# EAGLE design Schematic 1.0 (EAGLE 8.3.2)
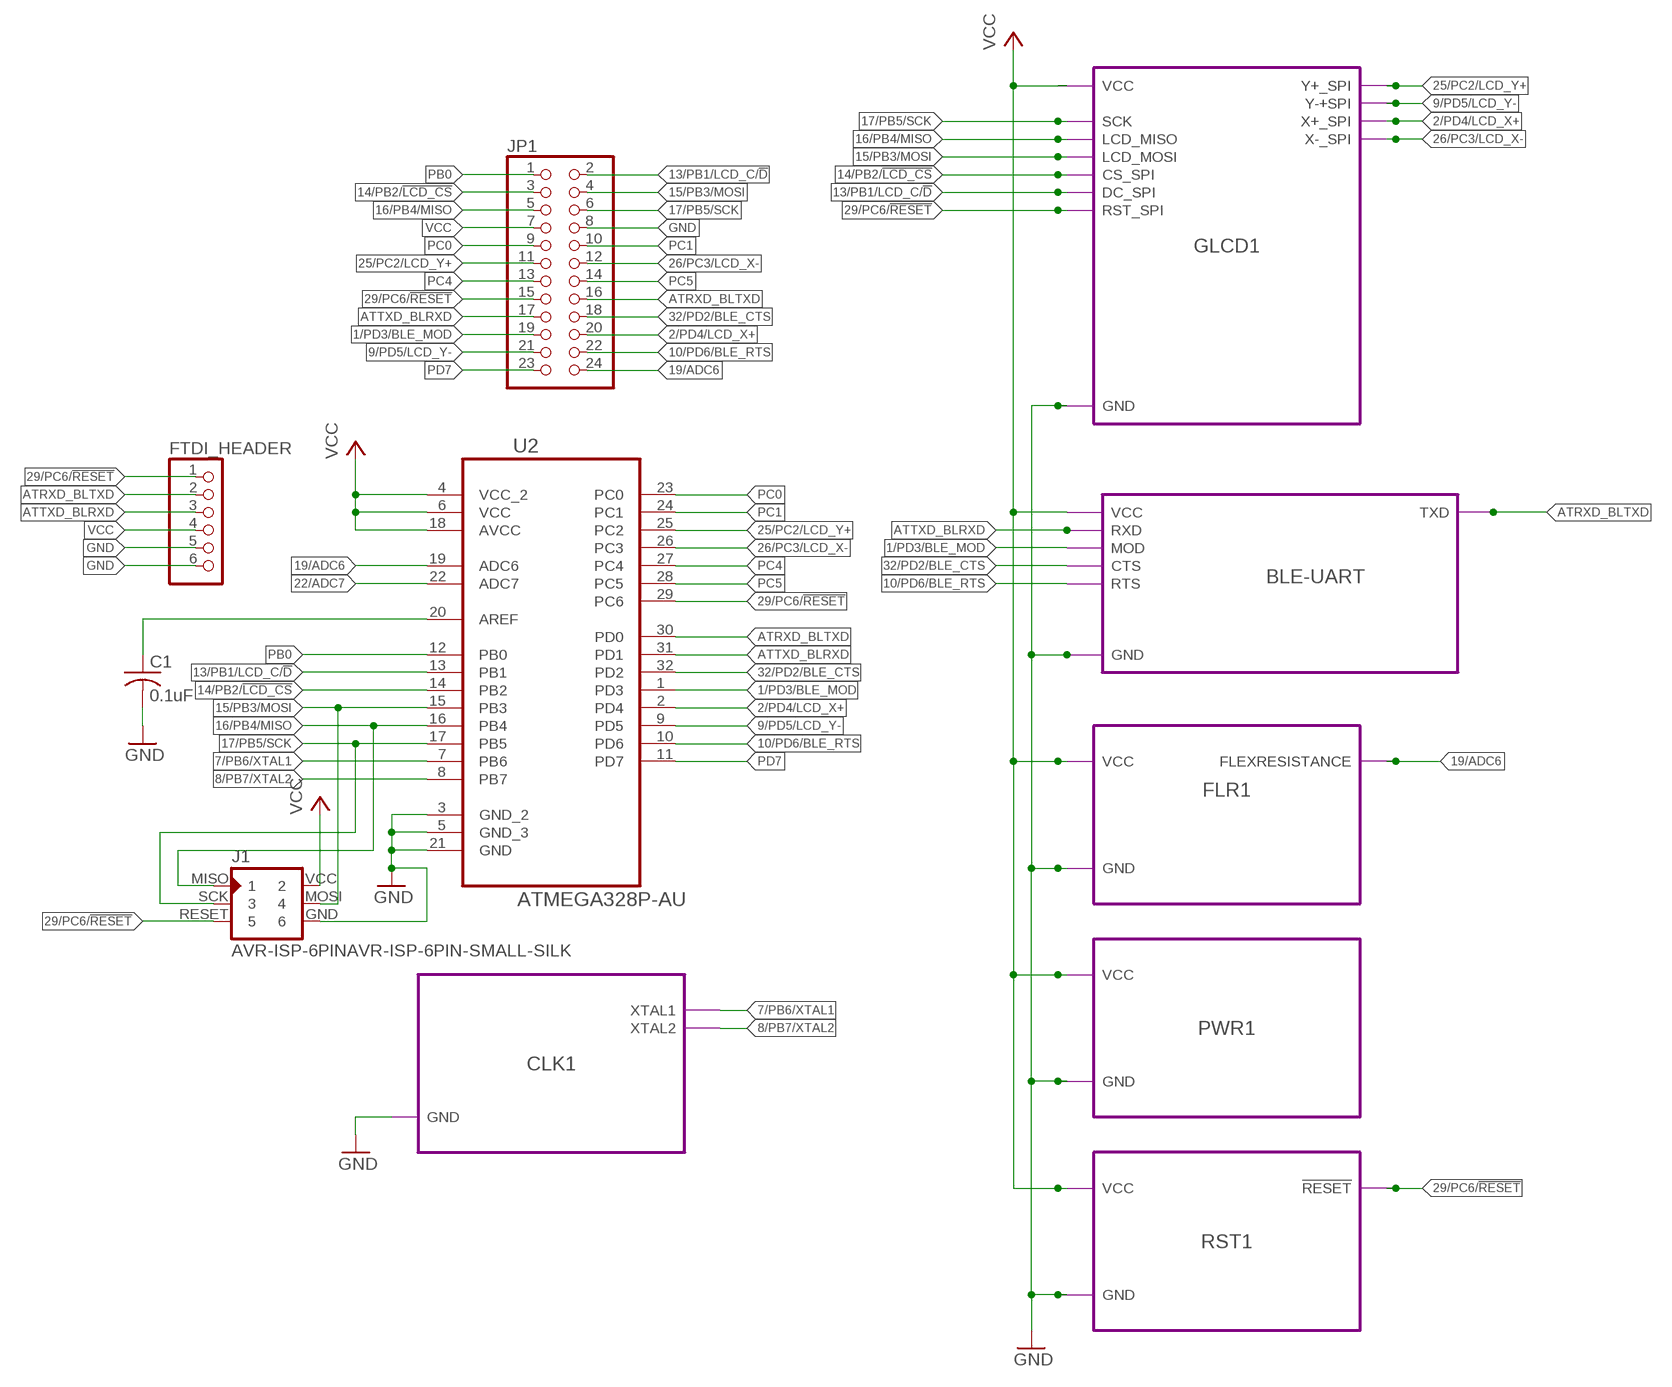
[diagram p0: schematic, sheet 1]

## Parts
C1  0.1uF  C-USC1206  [C1206]
FTDI_HEADER  PINHD-1X6  [1X06]
J1  AVR-ISP-6PINAVR-ISP-6PIN-SMALL-SILK  [AVR-ISP-6PIN-SMAILL-SILK]
JP1  PINHD-2X12  [2X12]
U2  ATMEGA328P-AU  [QFP80P900X900X120-32N]

## Module instances
BLE-UART = BLE-UART
GLCD1 = GLCD
FLR1 = FLRES
RST1 = RESET
PWR1 = POWER
CLK1 = CLOCK

## Nets
1/PD3/BLE_MOD: JP1.19 U2.1(PD3) ; port BLE-UART.MOD
2/PD4/LCD_X+: JP1.20 U2.2(PD4) ; port GLCD1.X+_SPI
7/PB6/XTAL1: U2.7(PB6) ; port CLK1.XTAL1
8/PB7/XTAL2: U2.8(PB7) ; port CLK1.XTAL2
9/PD5/LCD_Y-: JP1.21 U2.9(PD5) ; port GLCD1.Y-+SPI
10/PD6/BLE_RTS: JP1.22 U2.10(PD6) ; port BLE-UART.RTS
13/PB1/LCD_C/!D: JP1.2 U2.13(PB1) ; port GLCD1.DC_SPI
14/PB2/!LCD_CS: JP1.3 U2.14(PB2) ; port GLCD1.CS_SPI
15/PB3/MOSI: J1.MOSI JP1.4 U2.15(PB3) ; port GLCD1.LCD_MOSI
16/PB4/MISO: J1.MISO JP1.5 U2.16(PB4) ; port GLCD1.LCD_MISO
17/PB5/SCK: J1.SCK JP1.6 U2.17(PB5) ; port GLCD1.SCK
19/ADC6: JP1.24 U2.19(ADC6) ; port FLR1.FLEXRESISTANCE
22/ADC7: U2.22(ADC7)
25/PC2/LCD_Y+: JP1.11 U2.25(PC2) ; port GLCD1.Y+_SPI
26/PC3/LCD_X-: JP1.12 U2.26(PC3) ; port GLCD1.X-_SPI
29/PC6/!RESET: FTDI_HEADER.1 J1.RESET JP1.15 U2.29(PC6) ; port RST1.!RESET GLCD1.RST_SPI
32/PD2/BLE_CTS: JP1.18 U2.32(PD2) ; port BLE-UART.CTS
ATRXD_BLTXD: FTDI_HEADER.2 JP1.16 U2.30(PD0) ; port BLE-UART.TXD
ATTXD_BLRXD: FTDI_HEADER.3 JP1.17 U2.31(PD1) ; port BLE-UART.RXD
GND: C1.2 FTDI_HEADER.5 FTDI_HEADER.6 J1.GND JP1.8 U2.3(GND_2) U2.5(GND_3) U2.21(GND) ; port FLR1.GND RST1.GND PWR1.GND GLCD1.GND BLE-UART.GND CLK1.GND
N$1: C1.1 U2.20(AREF)
N$10: J1.VCC
PB0: JP1.1 U2.12(PB0)
PC0: JP1.9 U2.23(PC0)
PC1: JP1.10 U2.24(PC1)
PC4: JP1.13 U2.27(PC4)
PC5: JP1.14 U2.28(PC5)
PD7: JP1.23 U2.11(PD7)
VCC: FTDI_HEADER.4 JP1.7 U2.4(VCC_2) U2.6(VCC) U2.18(AVCC) ; port GLCD1.VCC FLR1.VCC RST1.VCC PWR1.VCC BLE-UART.VCC

## Library data of the parts
C1 = rcl:C-US: CAPACITOR, American symbol
FTDI_HEADER = pinhead:PINHD-1X6: PIN HEADER
J1 = avr-isp:AVR-ISP-6PIN: AVR ISP 6pin 3x2 pin header
JP1 = pinhead:PINHD-2X12: PIN HEADER
U2 = Atmel_By_element14_Batch_1-00:ATMEGA328P-AU: 8-bit Microcontroller with In-System Programmable Flash; MPN: ATMEGA328P-AU; OC_FARNELL: 1715486; OC_NEWARK: 14R4631; PACKAGE: TQFP-32; SUPPLIER: Atmel

## Module BLE-UART
Ports: VCC(pwr) GND(pwr) RXD(in) TXD(out) MOD(in) CTS(in) RTS(in)
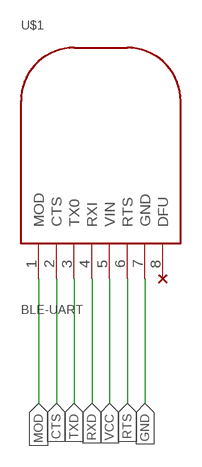
[diagram p1: schematic, module BLE-UART, sheet 1]

### Parts
U$1  BLE-UART  [BLE-UART]
U$2  NC  [NC]

### Nets
CTS: U$1.2(CTS)
GND: U$1.7(GND)
MOD: U$1.1(MOD)
RTS: U$1.6(RTS)
RXD: U$1.4(RXI)
TXD: U$1.3(TX0)
VCC: U$1.5(VIN)
Unconnected: U$1.8(DFU)

### Library data of the parts
U$1 = BLE-UART:BLE-UART
U$2 = Miscellaneous:NC: No Connect - NC Package created by Collin MD Peterson Description: No Connect Symbol without any pins (empty package associated with symbol)

## Module GLCD
Ports: VCC(pwr) GND(pwr) CS_SPI(in) DC_SPI(in) LCD_MISO(io) LCD_MOSI(io) RST_SPI(in) SCK(io) Y+_SPI(out) Y-+SPI(out) X+_SPI(out) X-_SPI(out)
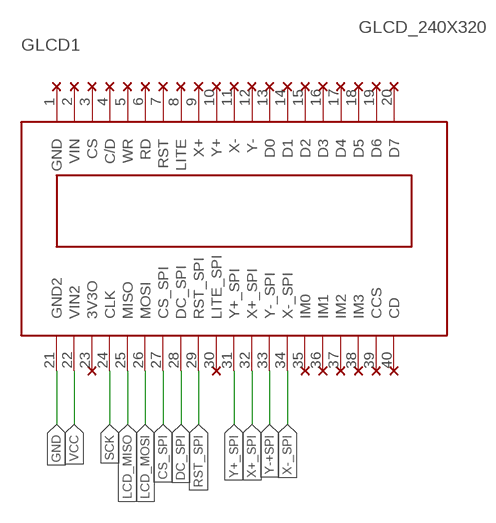
[diagram p2: schematic, module GLCD, sheet 1]

### Parts
GLCD1  GLCD_240X320  [GLCD_240X320]
U$1  NC  [NC]
U$2  NC  [NC]
U$3  NC  [NC]
U$4  NC  [NC]
U$5  NC  [NC]
U$6  NC  [NC]
U$7  NC  [NC]
U$8  NC  [NC]
U$9  NC  [NC]
U$10  NC  [NC]
U$11  NC  [NC]
U$12  NC  [NC]
U$13  NC  [NC]
U$14  NC  [NC]
U$15  NC  [NC]
U$16  NC  [NC]
U$17  NC  [NC]
U$18  NC  [NC]
U$19  NC  [NC]
U$20  NC  [NC]
U$21  NC  [NC]
U$22  NC  [NC]
U$23  NC  [NC]
U$24  NC  [NC]
U$25  NC  [NC]
U$26  NC  [NC]
U$27  NC  [NC]
U$29  NC  [NC]

### Nets
CS_SPI: GLCD1.27(CS_SPI)
DC_SPI: GLCD1.28(DC_SPI)
GND: GLCD1.21(GND2)
LCD_MISO: GLCD1.25(MISO)
LCD_MOSI: GLCD1.26(MOSI)
RST_SPI: GLCD1.29(RST_SPI)
SCK: GLCD1.24(CLK)
VCC: GLCD1.22(VIN2)
X+_SPI: GLCD1.32(X+_SPI)
X-_SPI: GLCD1.34(X-_SPI)
Y+_SPI: GLCD1.31(Y+_SPI)
Y-+SPI: GLCD1.33(Y-_SPI)
Unconnected: GLCD1.3(CS) GLCD1.4(C/D) GLCD1.5(WR) GLCD1.6(RD) GLCD1.7(RST) GLCD1.8(LITE) GLCD1.9(X+) GLCD1.10(Y+) GLCD1.11(X-) GLCD1.12(Y-) GLCD1.13(D0) GLCD1.14(D1) GLCD1.15(D2) GLCD1.16(D3) GLCD1.17(D4) GLCD1.18(D5) GLCD1.19(D6) GLCD1.20(D7) GLCD1.30(LITE_SPI) GLCD1.35(IM0) GLCD1.36(IM1) GLCD1.37(IM2) GLCD1.38(IM3) GLCD1.39(CCS) GLCD1.40(CD)

### Power pins joined to a net without a drawn wire
3V3O: GLCD1.23(3V3O)
GND: GLCD1.1(GND)
VIN: GLCD1.2(VIN)

### Library data of the parts
GLCD1 = GLCD_240X320:GLCD_240X320
U$1-U$27 U$29 = Miscellaneous:NC: No Connect - NC Package created by Collin MD Peterson Description: No Connect Symbol without any pins (empty package associated with symbol)

## Module FLRES
Ports: FLEXRESISTANCE(out) VCC(pwr) GND(pwr)
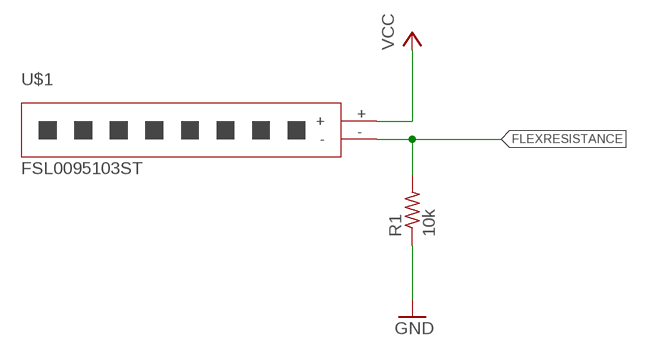
[diagram p3: schematic, module FLRES, sheet 1]

### Parts
R1  10k  R-US_R1206  [R1206]
U$1  FSL0095103ST  [FSL0095103ST]

### Nets
FLEXRESISTANCE: R1.2 U$1.-
GND: R1.1
VCC: U$1.+

### Library data of the parts
R1 = resistor:R-US_: RESISTOR, American symbol
U$1 = ATBTLC1000-MR110CA:FSL0095103ST

## Module RESET
Ports: VCC(pwr) GND(pwr) !RESET(out)
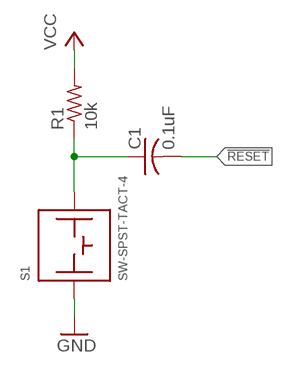
[diagram p4: schematic, module RESET, sheet 1]

### Parts
C1  0.1uF  C-USC1206  [C1206]
R1  10k  R-US_R1206  [R1206]
S1  SW-SPST-TACT-4  [SW-SPST-TACT-4]

### Nets
!RESET: C1.2
GND: S1.1B
N$1: C1.1 R1.1 S1.2A(2B)
VCC: R1.2
Unconnected: S1.1A S1.2B(2A)

### Library data of the parts
C1 = rcl:C-US: CAPACITOR, American symbol
R1 = resistor:R-US_: RESISTOR, American symbol
S1 = Switches:SW-SPST-TACT-4: SW-SPST-TACT-4 - Tactile Switch (Pushbutton) Package created by Collin MD Peterson Description: Single-Pull, Single-Throw Tactile Pushbutton 4 pins (1A & 1B connected, 2A & 2B connected) Uses swap level 0 (pins 1A and 2A) and 1 (pins 1B and 2B) Dimensions: Pins: Size: 6.5mm x 4.5mm Diameter: 1mm Case: Size: 6mm x 6mm Works For: TF25 Through Hole

## Module POWER
Ports: VCC(pwr) GND(pwr)
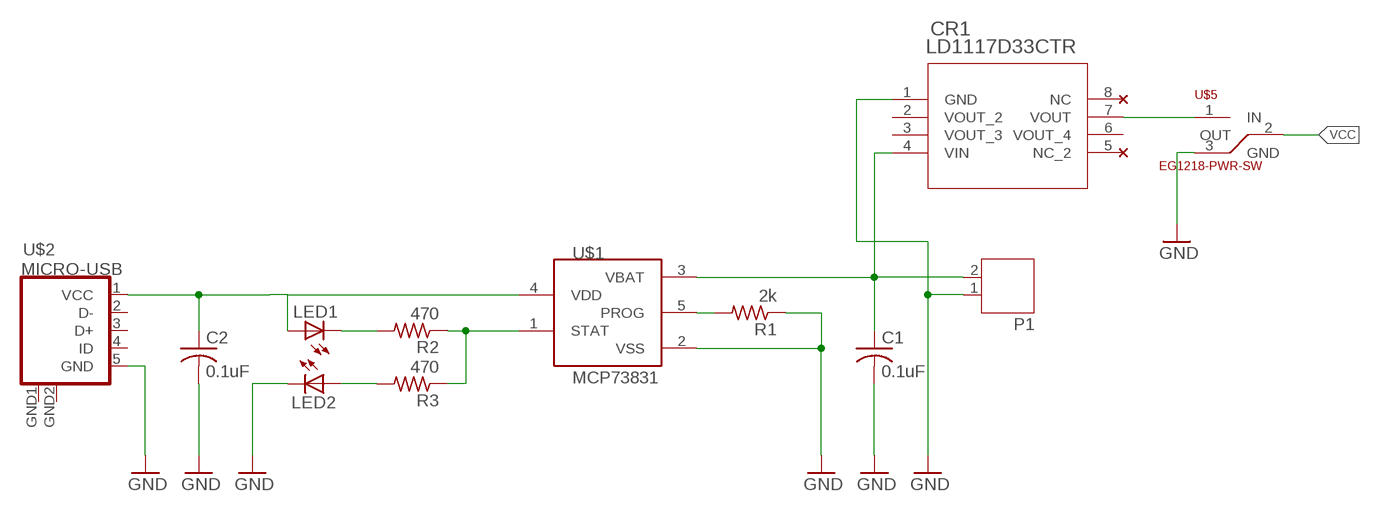
[diagram p5: schematic, module POWER, sheet 1]

### Parts
C1  0.1uF  C-USC1206  [C1206]
C2  0.1uF  C-USC1206  [C1206]
CR1  LD1117D33CTR  [SO-8]
LED1  LEDSMT1206  [1206]
LED2  LEDSMT1206  [1206]
P1  JST-PH2  [JST-PH2]
R1  2k  R-US_R1206  [R1206]
R2  470  R-US_R1206  [R1206]
R3  470  R-US_R1206  [R1206]
U$1  MCP73831  [SOT23-5L]
U$2  MICRO-USB  [MICRO-USB]
U$3  NC  [NC]
U$4  NC  [NC]
U$5  EG1218-PWR-SW  [EG1218-PWR-SW]

### Nets
GND: C1.2 C2.2 CR1.1(GND) LED2.C P1.1 R1.1 U$1.2(VSS) U$2.5(GND) U$5.3(GND)
N$1: C2.1 LED1.A U$1.4(VDD) U$2.1(VCC)
N$2: LED1.C R2.2
N$3: R2.1 R3.1 U$1.1(STAT)
N$4: LED2.A R3.2
N$5: R1.2 U$1.5(PROG)
N$6: CR1.7(VOUT) U$5.1(IN)
NS10: C1.1 CR1.4(VIN) P1.2 U$1.3(VBAT)
VCC: U$5.2(OUT)
Unconnected: CR1.2(VOUT_2) CR1.3(VOUT_3) CR1.5(NC_2) CR1.6(VOUT_4) CR1.8(NC) U$2.2(D-) U$2.3(D+) U$2.4(ID)

### Power pins joined to a net without a drawn wire
GND: U$2.GND1(GND) U$2.GND2(GND)

### Library data of the parts
C1 C2 = rcl:C-US: CAPACITOR, American symbol
CR1 = LD1117 SMD:LD1117D33CTR; MANUFACTURER_PART_NUMBER: LD1117D33CTR; VENDOR: STMicroelectronics
LED1 LED2 = led:LED: LED OSRAM: - CHIPLED LG R971, LG N971, LY N971, LG Q971, LY Q971, LO R971, LY R971 LH N974, LH R974 LS Q976, LO Q976, LY Q976 LO Q996 - Hyper CHIPLED LW Q18S LB Q993, LB Q99A, LB R99A - SideLED LS A670, LO A670, LY A670, LG A670, LP A670 LB A673, LV A673, LT A673, LW A673 LH A674 LY A675 LS A676, LA A676, LO A676, LY A676, LW A676 LS A679, LY A679, LG A679 - Hyper Micro SIDELED® LS Y876, LA Y876, LO Y876, LY Y876 LT Y87S - SmartLED LW L88C, LW L88S LB L89C, LB L89S, LG L890 LS L89K, LO L89K, LY L89K LS L896, LA L896, LO L896, LY L896 - TOPLED LS T670, LO T670, LY T670, LG T670, LP T670 LSG T670, LSP T670, LSY T670, LOP T670, LYG T670 LG T671, LOG T671, LSG T671 LB T673, LV T673, LT T673, LW T673 LH T674 LS T676, LA T676, LO T676, LY T676, LB T676, LH T676, LSB T676, LW T676 LB T67C, LV T67C, LT T67C, LS T67K, LO T67K, LY T67K, LW E67C LS E67B, LA E67B, LO E67B, LY E67B, LB E67C, LV E67C, LT E67C LW T67C LS T679, LY T679, LG T679 LS T770, LO T770, LY T770, LG T770, LP T770 LB T773, LV T773, LT T773, LW T773 LH T774 LS E675, LA E675, LY E675, LS T675 LS T776, LA T776, LO T776, LY T776, LB T776 LHGB T686 LT T68C, LB T68C - Hyper Mini TOPLED® LB M676 - Mini TOPLED Santana® LG M470 LS M47K, LO M47K, LY M47K Source: http://www.osram.convergy.de LUXEON: - LUMILED® LXK2-PW12-R00, LXK2-PW12-S00, LXK2-PW14-U00, LXK2-PW14-V00 LXK2-PM12-R00, LXK2-PM12-S00, LXK2-PM14-U00 LXK2-PE12-Q00, LXK2-PE12-R00, LXK2-PE12-S00, LXK2-PE14-T00, LXK2-PE14-U00 LXK2-PB12-K00, LXK2-PB12-L00, LXK2-PB12-M00, LXK2-PB14-N00, LXK2-PB14-P00, LXK2-PB14-Q00 LXK2-PR12-L00, LXK2-PR12-M00, LXK2-PR14-Q00, LXK2-PR14-R00 LXK2-PD12-Q00, LXK2-PD12-R00, LXK2-PD12-S00 LXK2-PH12-R00, LXK2-PH12-S00 LXK2-PL12-P00, LXK2-PL12-Q00, LXK2-PL12-R00 Source: www.luxeon.com KINGBRIGHT: KA-3528ASYC Source: www.kingbright.com
P1 = jst-ph:JST-PH2
R1-R3 = resistor:R-US_: RESISTOR, American symbol
U$1 = mcp73831:MCP73831: Miniature Single-Cell, Fully Integrated Li-Ion, Li-Polymer Charge Management Controllers
U$2 = microusb:MICRO-USB: Micro USB B connector
U$3 U$4 = Miscellaneous:NC: No Connect - NC Package created by Collin MD Peterson Description: No Connect Symbol without any pins (empty package associated with symbol)
U$5 = EG1218-PWR-SW:EG1218-PWR-SW

## Module CLOCK
Ports: XTAL1(out) XTAL2(out) GND(pwr)
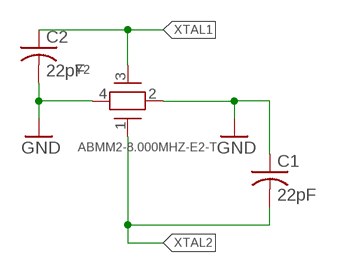
[diagram p6: schematic, module CLOCK, sheet 1]

### Parts
C1  22pF  C-USC1206  [C1206]
C2  22pF  C-USC1206  [C1206]
Y2  ABMM2-8.000MHZ-E2-T  [CRYSTAL_ABMM2]

### Nets
GND: C1.1 C2.2 Y2.2 Y2.4
XTAL1: C2.1 Y2.3
XTAL2: C1.2 Y2.1

### Library data of the parts
C1 C2 = rcl:C-US: CAPACITOR, American symbol
Y2 = 535-9628-1-ND:ABMM2-8.000MHZ-E2-T; MANUFACTURER_PART_NUMBER: ABMM28.000MHZE2T; VENDOR: Abracon

## Board
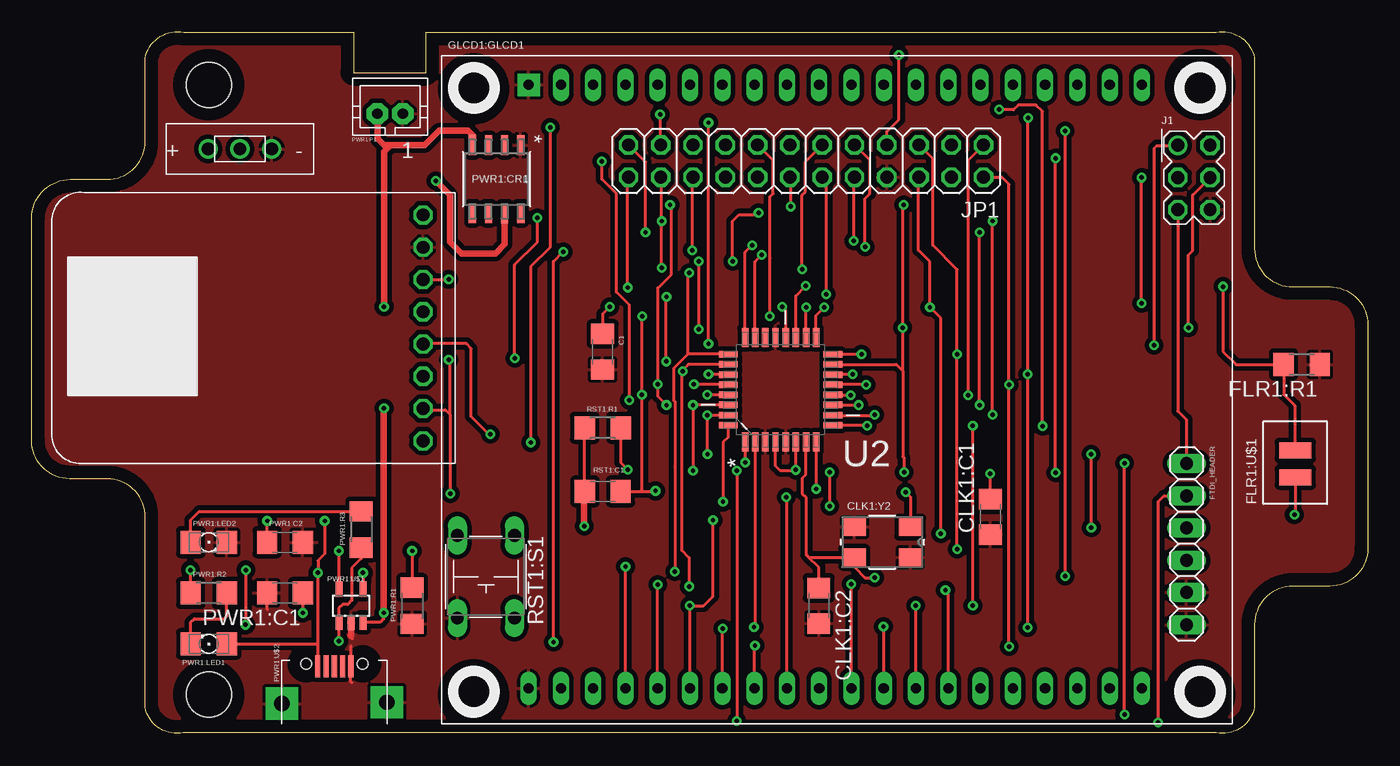
[diagram p7: board, top side]
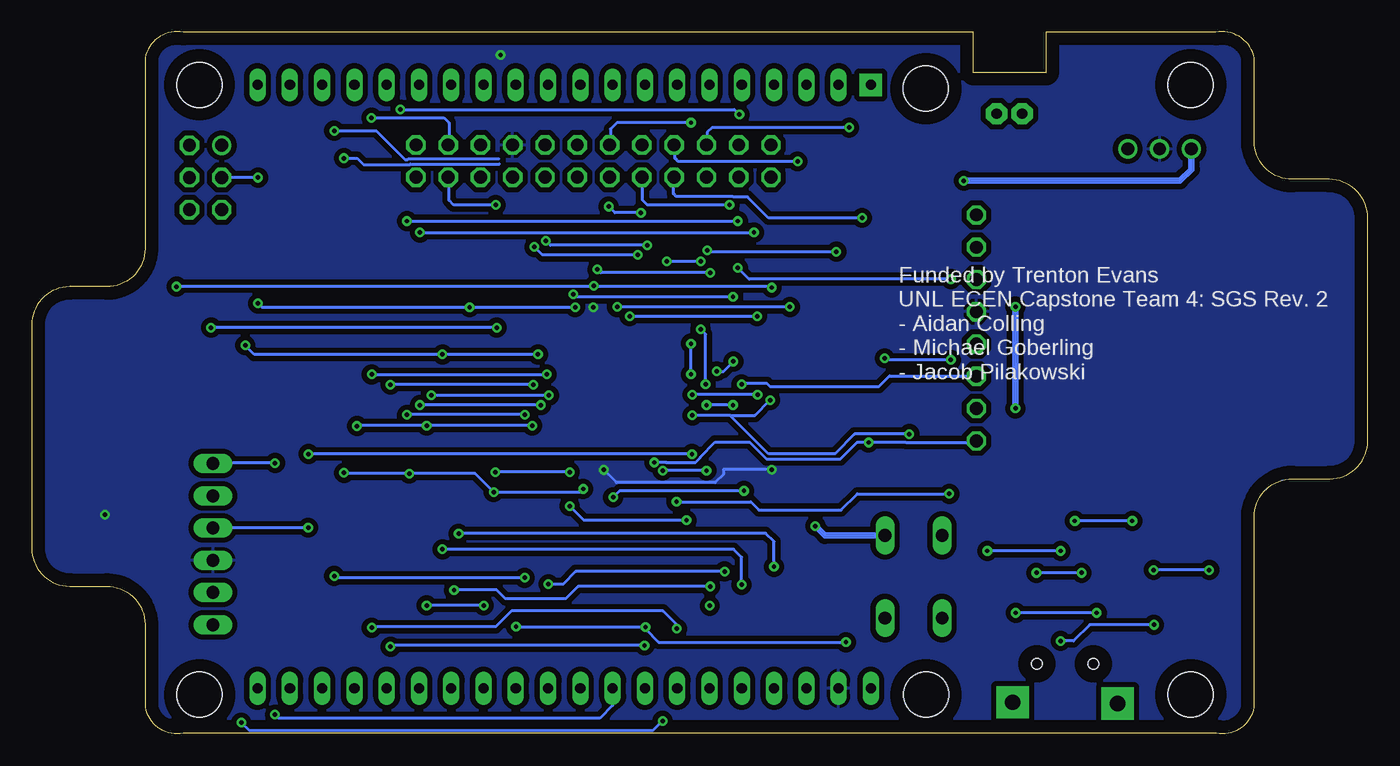
[diagram p8: board, bottom side, seen from below]

Size 105.12 x 55.23 mm. Coordinates in mm from the lower left corner, seen from the top.
Outline: 11.92,0.05 arc-90 8.93,2.04 8.93,17.05 arc90 5.93,20.04 2.99,20.04 arc-90 0,23.04 0,40.56 arc-90 3.04,43.61 5.93,43.61 arc90 8.93,46.6 8.93,53.16 arc-90 11.94,55.18 25.31,55.18 25.31,52.01 31.02,52.01 31.02,55.18 93.21,55.18 arc-90 96.21,53.17 96.21,38.15 arc90 99.21,35.15 102.13,35.15 arc-90 105.12,32.16 105.12,14.58 arc-90 102.12,11.58 99.22,11.58 arc90 96.21,8.57 96.21,2.05 arc-90 93.21,0.05 11.92,0.05
Copper layers (1*16): Top 0.035mm / dielectric 1.5mm / Bottom 0.035mm
Design rules "default": minimum track width 6mil, minimum drill 0.35mm, track to track 6mil, track to pad 6mil, pad to pad 6mil, via to via 6mil, smd to smd 6mil, copper to edge 40mil, drill to drill 6mil, minimum pad ring 10mil, minimum via ring 8mil, stop-mask expansion 4mil, vias tented up to drill 0mil, thermal gap 10mil
Holes 3.56 mm at 13.93,51.05 13.93,3.05 91.92,3.05 34.75,3.05 34.77,50.76
Holes 3.54 mm at 91.92,51.05

### Footprints (pad centres in the part's own frame; a part is rotated, then mirrored left to right if it is on the bottom)
BLE-UART = drill 1 pad 1.5 octagon: 1 1.778,2.54; 2 4.318,2.54; 3 6.858,2.54; 4 9.398,2.54; 5 11.938,2.54; 6 14.478,2.54; 7 17.018,2.54; 8 19.558,2.54
C1206 = smd 1.6 x 1.8: 1 -1.4,0; 2 1.4,0
CRYSTAL_ABMM2 = smd 1.397 x 1.803: 1 -1.194,2.197; 2 -1.194,-2.197; 3 1.194,-2.197; 4 1.194,2.197
R1206 = smd 1.6 x 1.803: 1 -1.422,0; 2 1.422,0
FSL0095103ST = smd 1.27 x 2.54: + 2.11,2.5; - 4.22,2.5
1X06 = drill 1.016 long: 1 -6.35,0; 2 -3.81,0; 3 -1.27,0; 4 1.27,0; 5 3.81,0; 6 6.35,0
GLCD_240X320 = drill 0.8 pad 1.778 square: 1 6.858,50.292 | drill 0.8 pad 1.27 long: 2 9.398,50.292; 3 11.938,50.292; 4 14.478,50.292; 5 17.018,50.292; 6 19.558,50.292; 7 22.098,50.292; 8 24.638,50.292; 9 27.178,50.292; 10 29.718,50.292; 11 32.258,50.292; 12 34.798,50.292; 13 37.338,50.292; 14 39.878,50.292; 15 42.418,50.292; 16 44.958,50.292; 17 47.498,50.292; 18 50.038,50.292; 19 52.578,50.292; 20 55.118,50.292; 21 6.858,2.794; 22 9.398,2.794; 23 11.938,2.794; 24 14.478,2.794; 25 17.018,2.794; 26 19.558,2.794; 27 22.098,2.794; 28 24.638,2.794; 29 27.178,2.794; 30 29.718,2.794; 31 32.258,2.794; 32 34.798,2.794; 33 37.338,2.794; 34 39.878,2.794; 35 42.418,2.794; 36 44.958,2.794; 37 47.498,2.794; 38 50.038,2.794; 39 52.578,2.794; 40 55.118,2.794
AVR-ISP-6PIN-SMAILL-SILK = drill 1.016 octagon: GND 1.27,-2.54; MOSI 1.27,0; RESET -1.27,-2.54; SCK -1.27,0; VCC 1.27,2.54 | drill 1.016: MISO -1.27,2.54
2X12 = drill 1.016 octagon: 1 -13.97,-1.27; 2 -13.97,1.27; 3 -11.43,-1.27; 4 -11.43,1.27; 5 -8.89,-1.27; 6 -8.89,1.27; 7 -6.35,-1.27; 8 -6.35,1.27; 9 -3.81,-1.27; 10 -3.81,1.27; 11 -1.27,-1.27; 12 -1.27,1.27; 13 1.27,-1.27; 14 1.27,1.27; 15 3.81,-1.27; 16 3.81,1.27; 17 6.35,-1.27; 18 6.35,1.27; 19 8.89,-1.27; 20 8.89,1.27; 21 11.43,-1.27; 22 11.43,1.27; 23 13.97,-1.27; 24 13.97,1.27
SO-8 = smd 1.549 x 0.559: 1 -2.68,1.905; 2 -2.68,0.635; 3 -2.68,-0.635; 4 -2.68,-1.905; 5 2.68,-1.905; 6 2.68,-0.635; 7 2.68,0.635; 8 2.68,1.905
1206 = smd 1.6 x 1.803: A -1.422,0; C 1.422,0
JST-PH2 = drill 0.813 pad 1.676 octagon: 1 1,0; 2 -1,0
SOT23-5L = smd 0.533 x 1.2: 1 -0.95,-1.3; 2 0,-1.3; 3 0.95,-1.3 | smd 0.55 x 1.2: 4 0.95,1.3; 5 -0.95,1.3
MICRO-USB = smd 0.4 x 1.75: 1 -1.3,4.525; 2 -0.65,4.525; 3 0,4.525; 4 0.65,4.525; 5 1.3,4.525 | drill 1.2 pad 2.54 square: GND1 -4.125,1.6; GND2 4.125,1.7 | hole 0.85: -2.225,4.73; 2.225,4.73
EG1218-PWR-SW = drill 1 pad 1.5: 1 3.3,2; 2 5.8,2; 3 8.3,2
SW-SPST-TACT-4 = drill 1 long: 1A -3.25,-2.25; 1B 3.25,-2.25; 2A -3.25,2.25; 2B 3.25,2.25
QFP80P900X900X120-32N = smd 1.473 x 0.508: 1 -4.115,2.794; 2 -4.115,2.007; 3 -4.115,1.194; 4 -4.115,0.406; 5 -4.115,-0.406; 6 -4.115,-1.194; 7 -4.115,-2.007; 8 -4.115,-2.794; 17 4.115,-2.794; 18 4.115,-2.007; 19 4.115,-1.194; 20 4.115,-0.406; 21 4.115,0.406; 22 4.115,1.194; 23 4.115,2.007; 24 4.115,2.794 | smd 0.508 x 1.473: 9 -2.794,-4.115; 10 -2.007,-4.115; 11 -1.194,-4.115; 12 -0.406,-4.115; 13 0.406,-4.115; 14 1.194,-4.115; 15 2.007,-4.115; 16 2.794,-4.115; 25 2.794,4.115; 26 2.007,4.115; 27 1.194,4.115; 28 0.406,4.115; 29 -0.406,4.115; 30 -1.194,4.115; 31 -2.007,4.115; 32 -2.794,4.115

### Placement (x,y rotation side)
BLE-UART:U$1  BLE-UART  [BLE-UART]  33.33,21.25 90 top
BLE-UART:U$2  NC  [NC]  19.34,-13.4 0 top  (outside the outline)
C1  44.92,30.05 270 top
CLK1:C1  22pF  [C1206]  75.42,17.05 90 top
CLK1:C2  22pF  [C1206]  61.92,10.05 270 top
CLK1:Y2  ABMM2-8.000MHZ-E2-T  [CRYSTAL_ABMM2]  66.92,15.05 270 top
FLR1:R1  10k  [R1206]  99.92,29.05 180 top
FLR1:U$1  FSL0095103ST  [FSL0095103ST]  101.92,18.05 90 top
FTDI_HEADER  90.87,14.9 270 top
GLCD1:GLCD1  GLCD_240X320  [GLCD_240X320]  32.24,0.76 0 top
GLCD1:U$1  NC  [NC]  20.36,-8.57 0 top  (outside the outline)
GLCD1:U$2  NC  [NC]  20.36,-9.84 0 top  (outside the outline)
GLCD1:U$3  NC  [NC]  20.36,-11.11 0 top  (outside the outline)
GLCD1:U$4  NC  [NC]  20.36,-12.38 0 top  (outside the outline)
GLCD1:U$5  NC  [NC]  39.66,-30.41 0 top  (outside the outline)
GLCD1:U$6  NC  [NC]  39.66,-31.68 0 top  (outside the outline)
GLCD1:U$7  NC  [NC]  39.66,-32.95 0 top  (outside the outline)
GLCD1:U$8  NC  [NC]  39.66,-34.22 0 top  (outside the outline)
GLCD1:U$9  NC  [NC]  39.66,-35.49 0 top  (outside the outline)
GLCD1:U$10  NC  [NC]  39.66,-36.76 0 top  (outside the outline)
GLCD1:U$11  NC  [NC]  39.66,-38.03 0 top  (outside the outline)
GLCD1:U$12  NC  [NC]  39.66,-39.3 0 top  (outside the outline)
GLCD1:U$13  NC  [NC]  39.66,-40.57 0 top  (outside the outline)
GLCD1:U$14  NC  [NC]  39.66,-41.84 0 top  (outside the outline)
GLCD1:U$15  NC  [NC]  39.66,-43.11 0 top  (outside the outline)
GLCD1:U$16  NC  [NC]  39.66,-44.38 0 top  (outside the outline)
GLCD1:U$17  NC  [NC]  39.66,-45.65 0 top  (outside the outline)
GLCD1:U$18  NC  [NC]  39.66,-46.92 0 top  (outside the outline)
GLCD1:U$19  NC  [NC]  39.66,-48.19 0 top  (outside the outline)
GLCD1:U$20  NC  [NC]  39.66,-49.46 0 top  (outside the outline)
GLCD1:U$21  NC  [NC]  39.66,-50.73 0 top  (outside the outline)
GLCD1:U$22  NC  [NC]  39.66,-52 0 top  (outside the outline)
GLCD1:U$23  NC  [NC]  39.66,-53.27 0 top  (outside the outline)
GLCD1:U$24  NC  [NC]  39.66,-54.54 0 top  (outside the outline)
GLCD1:U$25  NC  [NC]  39.66,-55.81 0 top  (outside the outline)
GLCD1:U$26  NC  [NC]  39.66,-57.08 0 top  (outside the outline)
GLCD1:U$27  NC  [NC]  39.66,-58.35 0 top  (outside the outline)
GLCD1:U$29  NC  [NC]  39.66,-60.89 0 top  (outside the outline)
J1  91.45,43.75 0 top
JP1  60.92,45.05 180 top
PWR1:C1  0.1uF  [C1206]  19.93,11.05 180 top
PWR1:C2  0.1uF  [C1206]  19.93,15.05 0 top
PWR1:CR1  LD1117D33CTR  [SO-8]  36.58,43.63 270 top
PWR1:LED1  [1206]  13.93,7.05 180 top
PWR1:LED2  [1206]  13.93,15.05 0 top
PWR1:P1  [JST-PH2]  28.2,48.78 0 top
PWR1:R1  2k  [R1206]  29.93,10.05 90 top
PWR1:R2  470  [R1206]  13.93,11.05 0 top
PWR1:R3  470  [R1206]  25.93,16.05 90 top
PWR1:U$1  MCP73831  [SOT23-5L]  25.12,10.05 0 top
PWR1:U$2  MICRO-USB  [MICRO-USB]  23.81,0.75 0 top
PWR1:U$3  NC  [NC]  36.34,50.45 90 top
PWR1:U$4  NC  [NC]  37.36,49.44 90 top
PWR1:U$5  EG1218-PWR-SW  [EG1218-PWR-SW]  10.58,44.01 0 top
RST1:C1  0.1uF  [C1206]  44.92,19.05 0 top
RST1:R1  10k  [R1206]  44.92,24.05 0 top
RST1:S1  SW-SPST-TACT-4  [SW-SPST-TACT-4]  35.74,12.33 270 top
U2  58.92,27.05 90 top

### Tracks (layer width: path | path; a pad name or v marks a point on that pad's centre or on a via)
1/PD3/BLE_MOD  (via drill 0.35)
  Top 0.254: U2.1 v56.13,21.33 | v56.13,21.33 | v39.28,22.9 39.28,36.77 40.8,38.29 v40.8,47.69
  Bottom 0.254: 39.28,22.93 40.17,22.93 41.49,21.6 47.32,21.6 48.64,22.93 51.34,22.93 52.51,21.75 52.51,21.71 52.9,21.33 55.19,21.33 55.21,21.35 55.76,21.35 55.78,21.33 v56.13,21.33 | 39.28,22.93 36.37,22.93 36.35,22.9 30.91,22.9 BLE-UART:U$1.1 | 39.28,22.93 v39.28,22.9 | v40.8,47.69 51.6,47.69 51.98,47.31 51.98,46.38 JP1.19
2/PD4/LCD_X+  (via drill 0.35)
  Top 0.254: GLCD1:GLCD1.32 67.04,8.38 v67.02,8.4 | U2.2 56.92,8.46 v56.83,8.37 | v41.06,7.18 41.06,37.15 v41.82,37.91 | v51.98,38.04 51.98,43.72 JP1.20
  Bottom 0.254: v67.02,8.4 66.99,8.37 v56.83,8.37 56.83,8.22 55.79,7.18 v41.06,7.18 | v41.82,37.91 51.85,37.91 v51.98,38.04
7/PB6/XTAL1  (via drill 0.35)
  Top 0.254: 61.12,13.86 CLK1:Y2.3 64.73,13.1 65.57,12.26 v66.33,12.26 | 61.12,13.86 60.94,14.04 60.94,18.56 60.64,18.86 60.64,20.11 60.92,20.39 60.92,22.92 U2.7 | CLK1:C2.1 61.92,13.06 61.12,13.86 | v81.31,12.38 v81.31,47.44
  Bottom 0.254: v66.33,12.26 81.19,12.26 v81.31,12.38 | v81.31,47.44 78.01,47.44 75.75,45.18 75.55,45.18 75.49,45.23 68.37,45.23
8/PB7/XTAL2  (via drill 0.35)
  Top 0.254: CLK1:Y2.1 69.12,18.63 v68.77,18.99 | v61.73,19.24 61.73,22.92 U2.8 | CLK1:C1.2 v75.42,20.45 | v80.55,20.51 v80.55,45.28
  Bottom 0.254: v61.73,19.24 61.99,18.99 v68.77,18.99 70.23,20.45 v75.42,20.45 80.49,20.45 v80.55,20.51 | v80.55,45.28 79.54,45.28 79.03,44.77 75.38,44.77 75.33,44.82 68.32,44.82
9/PD5/LCD_Y-  (via drill 0.35)
  Top 0.254: GLCD1:GLCD1.33 69.58,10.05 v69.56,10.07 | v74.05,10.07 v74.05,24.22 | v65.75,24.22 63.07,24.22 U2.9 | v79.54,24.2 79.54,48.96 79.03,49.47 77.63,49.47 77.25,49.09 76.13,49.09 v76.11,49.11 | v49.44,48.71 49.44,46.38 JP1.21
  Bottom 0.254: v69.56,10.07 v74.05,10.07 | v65.75,24.22 v74.05,24.22 79.51,24.22 v79.54,24.2 | v76.11,49.11 49.84,49.11 v49.44,48.71
10/PD6/BLE_RTS  (via drill 0.35)
  Top 0.254: U2.10 66.29,25.04 v66.33,25.08 | v75.6,25.08 v75.6,40.32 | JP1.22 49.56,43.71 v49.56,40.32 v49.56,36.64 | BLE-UART:U$1.6 32.78,35.73 v32.8,35.75
  Bottom 0.254: v66.33,25.08 v75.6,25.08 | v75.6,40.32 v49.56,40.32 | v32.8,35.75 48.68,35.75 v49.56,36.64
13/PB1/LCD_C/!D  (via drill 0.35)
  Top 0.254: GLCD1:GLCD1.28 56.88,6.89 v56.91,6.92 | v76.89,6.82 v76.89,27.45 76.89,43.22 76.36,43.75 74.92,43.75 JP1.2 | v65.64,27.45 63.05,27.45 U2.13
  Bottom 0.254: v56.91,6.92 76.79,6.92 v76.89,6.82 | v65.64,27.45 v76.89,27.45
14/PB2/!LCD_CS  (via drill 0.35)
  Top 0.254: GLCD1:GLCD1.27 54.34,8.21 v54.37,8.24 | v78.37,8.32 v78.37,28.26 78.37,48.43 v78.39,48.45 | v64.6,28.26 63.06,28.26 U2.14
  Bottom 0.254: v54.37,8.24 54.37,8.55 55.46,9.64 67.37,9.64 68.61,8.4 78.29,8.4 v78.37,8.32 | v78.37,28.26 v64.6,28.26 | v78.39,48.45 72.68,48.45 72.3,48.07 72.3,46.38 JP1.3
15/PB3/MOSI  (via drill 0.35)
  Top 0.254: GLCD1:GLCD1.26 51.8,10.03 v51.78,10.05 52.87,10.05 53.6,10.78 v53.6,16.78 | v62.8,17.9 v62.8,20.56 | U2.15 63.05,29.05 68.03,29.05 68.54,28.54 | 68.5,31.9 v68.54,31.94 | v91.02,31.94 91.02,37.66 91.35,37.99 91.35,42.38 J1.MOSI | 68.54,28.54 v68.54,31.94 | 68.54,28.54 68.54,21.78 68.61,21.71 68.61,20.59 v68.64,20.56 | v68.54,31.94 68.54,41.52 v68.61,41.59
  Bottom 0.254: v53.6,16.78 61.68,16.78 v62.8,17.9 | v62.8,20.56 v68.64,20.56 | v68.54,31.94 v91.02,31.94 91.04,31.92 | v68.61,41.59 71.92,41.59 72.3,41.98 72.3,43.72 JP1.4
16/PB4/MISO  (via drill 0.35)
  Top 0.254: GLCD1:GLCD1.25 v49.26,11.69 v49.26,11.7 | v72.81,14.49 v72.81,29.83 72.81,36.51 70.9,38.42 70.9,45.23 JP1.5 | v65.29,29.83 63.05,29.83 U2.16 | v88.33,30.55 88.33,46.05 88.52,46.25 90.14,46.25 J1.MISO
  Bottom 0.254: v49.26,11.7 49.26,13.86 49.89,14.49 v72.81,14.49 | v65.29,29.83 v72.81,29.83 87.61,29.83 v88.33,30.55
17/PB5/SCK  (via drill 0.35)
  Top 0.254: GLCD1:GLCD1.24 v46.72,13.12 | U2.17 61.72,32.9 v62.37,33.54 | v71.54,15.71 71.54,32.68 v70.67,33.54 70.67,37.12 69.76,38.04 69.76,43.72 JP1.6 | v87.33,33.85 v87.33,43.75
  Bottom 0.254: v46.72,13.12 46.72,15.1 47.38,15.76 71.48,15.76 v71.54,15.71 | v87.33,33.85 87.02,33.54 v70.67,33.54 v62.37,33.54 | v87.33,43.75 J1.SCK
19/ADC6  (via drill 0.35)
  Top 0.254: 98.5,29.02 FLR1:R1.2 | 98.5,29.02 98.5,26.67 99.37,25.8 99.37,22.32 FLR1:U$1.- | U2.19 60.12,34.44 v60.89,35.22 | v93.74,35.17 93.74,30.06 94.78,29.02 98.5,29.02 | v46.9,35.09 46.9,43.72 JP1.24
  Bottom 0.254: v93.74,35.17 93.69,35.22 v60.89,35.22 47.02,35.22 v46.9,35.09
25/PC2/LCD_Y+  (via drill 0.35)
  Top 0.254: GLCD1:GLCD1.31 64.5,6.9 | U2.25 51.63,29.84 | 51.63,29.84 50.53,28.74 50.53,26.19 50.6,26.12 50.6,21 | 50.61,21 50.6,21 | 50.6,21 v50.6,12.74 v50.61,12.74 | 64.47,6.92 64.5,6.9 | 64.5,6.9 64.5,11.73 v64.47,11.75 | 51.63,29.84 51.63,36.17 v51.72,36.26 | v60.61,36.51 60.61,42.36 60.87,42.61 60.87,44.99 JP1.11
  Bottom 0.254: v50.61,12.74 62.32,12.74 63.31,11.75 v64.47,11.75 | v51.72,36.26 60.36,36.26 v60.61,36.51
26/PC3/LCD_X-  (via drill 0.35)
  Top 0.254: U2.26 51.66,29.06 51.17,28.56 | v51.75,11.57 51.72,11.6 51.72,13.83 51.17,14.39 51.17,28.56 | v71.89,11.27 71.89,11.14 72.09,10.94 72.09,3.57 GLCD1:GLCD1.34 | 51.17,28.56 v51.22,28.51 | v49.92,29.28 49.92,34.33 v49.95,34.36 | v62.52,34.56 62.52,43.46 JP1.12
  Bottom 0.254: v51.75,11.57 62.14,11.57 63.1,10.61 67.85,10.61 68.54,11.29 71.87,11.29 v71.89,11.27 | v51.22,28.51 50.69,28.51 v49.92,29.28 | v49.95,34.36 62.27,34.36 62.52,34.61 v62.52,34.56
29/PC6/!RESET  (via drill 0.35)
  Top 0.254: RST1:C1.2 47.87,19.05 | 47.87,19.05 48.02,19.19 v48.02,26.66 48.02,32.81 v48.04,32.83 | v53.15,26.66 54.79,26.66 U2.29 | 47.87,19.05 49.04,19.05 v49.08,19.09 | v59.37,18.58 59.37,3.6 GLCD1:GLCD1.29 | J1.RESET 90.18,25.36 90.84,24.7 90.84,21.27 FTDI_HEADER.1 | v85.99,1.49 v85.99,21.27 | v58.07,32.83 58.07,37.36 58.1,37.39 58.1,42.25 58.33,42.48 58.33,45.11 JP1.15
  Bottom 0.254: v48.02,26.66 v53.15,26.66 | v49.08,19.09 58.86,19.09 v59.37,18.58 | GLCD1:GLCD1.29 59.42,2.2 60.41,1.21 85.71,1.21 v85.99,1.49 | v85.99,21.27 90.84,21.27 FTDI_HEADER.1 | v48.04,32.83 v58.07,32.83
32/PD2/BLE_CTS  (via drill 0.35)
  Top 0.254: U2.32 54.81,23.34 54.39,22.93 v54.39,18.23 | BLE-UART:U$1.2 30.89,25.47 32.55,25.47 32.93,25.08 | v38.01,29.53 38.01,36.9 39.79,38.67 v39.79,40.58 | 32.93,25.08 v32.93,18.86 | 32.93,25.08 32.93,29.28 v32.8,29.4
  Bottom 0.254: v54.39,18.23 48.55,18.23 47.91,17.59 41.44,17.59 40.17,18.86 v32.93,18.86 | v32.8,29.4 37.88,29.4 v38.01,29.53 | v39.79,40.58 47.15,40.58 48.8,42.23 49.93,42.23 49.95,42.25 54.41,42.25 54.64,42.48 54.64,43.71 JP1.18
ATRXD_BLTXD  (via drill 0.35)
  Top 0.254: v49.95,25.85 49.26,26.53 v49.26,27.47 49.26,35.07 50.33,36.13 50.33,41.49 v50.22,41.59 | U2.30 54.8,25.85 v52.03,25.85 v52.03,20.69 | v55.48,20.69 v55.48,0.98 | v88.63,0.85 88.63,18.25 89.09,18.71 FTDI_HEADER.2
  Bottom 0.254: v49.26,27.47 49.18,27.55 47.28,27.55 47.03,27.29 38.47,27.29 37.63,28.13 30.81,28.13 BLE-UART:U$1.3 | v49.95,25.85 v52.03,25.85 | v52.03,20.69 v55.48,20.69 | v55.48,0.98 55.51,0.98 56.27,0.22 87.99,0.22 v88.63,0.85 | v50.22,41.59 56.68,41.59 57.06,41.98 57.06,43.72 JP1.16
ATTXD_BLRXD  (via drill 0.35)
  Top 0.254: v36.08,23.56 35.95,23.56 34.58,24.93 34.58,30.29 34.2,30.67 30.81,30.67 BLE-UART:U$1.4 | U2.31 54.79,25.06 54.77,25.03 v53.15,25.03 53.15,22.01 v53.17,21.99 | v83.35,21.99 83.35,16.22 v83.37,16.19 | v47.03,26.23 47.03,33.72 46.01,34.74 46.01,42.48 44.87,43.63 v44.87,45.02
  Bottom 0.254: v36.08,23.56 40.37,23.56 41.92,22.01 47.15,22.01 50.17,25.03 | 50.17,25.03 v53.15,25.03 | v53.17,21.99 v83.35,21.99 | v83.37,16.19 90.84,16.19 FTDI_HEADER.3 | 50.17,25.03 48.22,25.03 v47.03,26.23 | v44.87,45.02 54.26,45.02 54.52,45.28 54.52,46.26 JP1.17
GND
  Top 0.254: 25.18,4 25.11,4.07 PWR1:U$2.5 25.11,6.87 | 25.11,7.69 25.11,7.57 25.23,7.45 | 18.52,9.75 PWR1:C1.2
  Top 0.508: PWR1:U$1.2 25.12,7.7 25.11,7.69
  pour Top (isolate 0.356): 12.28,0.16 arc-90 9.28,2.16 9.28,17.16 arc90 6.28,20.16 3.39,20.16 arc-90 0.38,23.17 0.38,40.68 arc-90 3.38,43.68 6.28,43.68 arc90 9.28,46.68 9.28,53.21 arc-90 12.33,55.26 93.58,55.26 arc-90 96.55,53.28 96.55,38.24 arc90 99.53,35.26 102.5,35.26 arc-90 105.47,32.3 105.47,14.7 arc-90 102.47,11.7 99.52,11.7 arc90 96.55,8.72 96.55,2.17 arc-90 93.53,0.16
N$1  (via drill 0.35)
  Top 0.254: U2.20 59.33,33.3 v59.06,33.57 | v45.48,33.57 44.92,33.01 C1.1
  Bottom 0.254: v45.48,33.57 v59.06,33.57
N$2
  Bottom 0: 11.93,0.05 arc-90 8.93,2.05 8.93,17.05 arc90 5.93,20.05 3.03,20.05
PB0  (via drill 0.35)
  Top 0.254: U2.12 64.39,26.64 v64.42,26.61 | v73.69,26.61 73.69,45.12 JP1.1
  Bottom 0.254: v64.42,26.61 v73.69,26.61
PC0  (via drill 0.35)
  Top 0.254: U2.23 56.92,37.14 v57.44,37.66 | v65.57,38.29 65.57,42.1 65.95,42.48 65.95,45.11 JP1.9
  Bottom 0.254: v57.44,37.66 64.93,37.66 v65.57,38.29
PC1  (via drill 0.35)
  Top 0.254: U2.24 56.13,37.87 v56.68,38.42 | v64.68,38.78 64.68,43.72 JP1.10
  Bottom 0.254: v56.68,38.42 64.32,38.42 v64.68,38.78
PC4  (via drill 0.35)
  Top 0.254: U2.27 53.26,28.24 v53.25,28.26 | v53.25,30.67 v53.25,48.07
  Bottom 0.254: v53.25,28.26 v53.25,30.67 | v53.25,48.07 59.09,48.07 59.6,47.56 59.6,46.38 JP1.13
PC5  (via drill 0.35)
  Top 0.254: U2.28 52.15,27.46 v52.11,27.5 | v52.49,31.82 v52.49,37.15 | v55.15,37.15 55.15,40.32 55.66,40.83 57.03,40.83 v57.19,40.98 | v59.72,41.47 59.72,43.71 JP1.14
  Bottom 0.254: v52.11,27.5 52.11,31.43 v52.49,31.82 | v52.49,37.15 v55.15,37.15 | v57.19,40.98 59.24,40.98 v59.72,41.47
PD7  (via drill 0.35)
  Top 0.254: U2.11 v65.05,25.86 v65.06,25.85 | v74.58,25.85 v74.58,39.44 | v48.3,39.44 48.3,44.98 JP1.23
  Bottom 0.254: v65.06,25.85 v74.58,25.85 | v74.58,39.44 v48.3,39.44
PWR1:N$1  (via drill 0.35)
  Top 0.254: 22.51,7 PWR1:U$2.1 | v22.51,12.63 22.51,7 | v22.51,12.63 v22.51,12.64 | v26.07,12.64 PWR1:U$1.4 | PWR1:LED1.A 22.46,7.05 22.51,7 | PWR1:C2.1 v18.52,16.73 v18.53,16.73 | v23.05,16.73 23.05,14.14 22.51,13.6 v22.51,12.64 | v22.51,12.64 v22.51,12.63
  Bottom 0.254: v22.51,12.64 v26.07,12.64 | v18.53,16.73 v23.05,16.73
PWR1:N$2
  Top 0.254: PWR1:LED1.C 12.5,8.72 12.81,9.03 15.15,9.03 15.35,9.23 PWR1:R2.2
PWR1:N$3  (via drill 0.35)
  Top 0.254: PWR1:R2.1 12.5,12.85 v12.48,12.87 | v16.85,12.87 16.85,8.57 v16.82,8.55 | 24.16,8.65 v24.16,7.28 | 24.16,8.65 PWR1:U$1.1 | PWR1:R3.1 25.93,13.76 25.18,13.02 25.18,10.45 24.88,10.15 24.44,10.15 24.16,9.87 24.16,8.65
  Bottom 0.254: v12.48,12.87 v16.85,12.87 | v16.82,8.55 21.88,8.55 23.15,7.28 v24.16,7.28
PWR1:N$4
  Top 0.254: PWR1:LED2.A 12.5,16.8 13.17,17.46 PWR1:R3.2
PWR1:N$5  (via drill 0.35)
  Top 0.254: PWR1:U$1.5 24.18,14.36 v24.16,14.37 | v29.93,14.37 PWR1:R1.2
  Bottom 0.254: v24.16,14.37 v29.93,14.37
PWR1:N$6  (via drill 0.35)
  Top 0.508: PWR1:CR1.7 37.21,38.51 36.48,37.78 33.82,37.78 32.93,38.67 32.93,42.36 v31.79,43.5
  Bottom 0.508: PWR1:U$5.1 13.88,44.39 14.77,43.5 v31.79,43.5
PWR1:NS10  (via drill 0.35)
  Top 0.254: PWR1:C1.1 v21.33,9.49 v21.32,9.49 | v27.7,9.49 27.7,9.01 27.44,8.75 PWR1:U$1.3
  Top 0.508: PWR1:CR1.4 34.71,46.34 34.71,47.06 34.33,47.44 32.04,47.44 30.9,46.29 28.23,46.29 | 28.23,46.29 27.72,46.29 27.21,46.8 27.21,48.76 PWR1:P1.2 | v27.7,9.49 27.7,25.57 v27.72,25.59 | 28.23,46.29 27.72,45.79 v27.72,33.59
  Bottom 0.254: v21.32,9.49 v27.7,9.49
  Bottom 0.508: v27.72,25.59 v27.72,33.59
RST1:N$1  (via drill 0.35)
  Top 0.254: RST1:R1.1 43.5,19.24 43.5,19.07 RST1:C1.1
  Top 0.508: v43.47,16.32 43.47,19.21 43.5,19.24
  Bottom 0.508: RST1:S1.2A 42.73,15.58 v43.47,16.32
VCC  (via drill 0.35)
  Top 0.254: U2.18 60.93,33.53 v60.94,33.54 | 60.12,20.77 U2.6 | 60.12,20.77 60.12,20.75 v60.11,20.74 | U2.4 58.52,21.06 58.86,20.72 60.07,20.72 60.12,20.77 | FLR1:U$1.+ 99.42,17.29 v99.35,17.21 | JP1.7 67.28,47.37 68.23,48.33 v68.23,53.41 | RST1:R1.2 46.35,21.32 v46.9,20.77
  Bottom 0.254: v46.9,20.77 50.71,20.77 50.71,20.39 51.34,19.75 59.11,19.75 v60.11,20.74
  pour Bottom (isolate 0.406): 11.93,0.05 arc-90 8.93,2.05 8.93,17.05 arc90 5.93,20.05 3.04,20.05 arc-90 0.03,23.06 0.03,40.57 arc-90 3.03,43.57 5.93,43.57 arc90 8.93,46.57 8.93,53.1 arc-90 11.98,55.15 93.22,55.15 arc-90 96.2,53.17 96.2,38.13 arc90 99.19,35.15 102.16,35.15 arc-90 105.11,32.19 105.11,14.59 arc-90 102.11,11.59 99.17,11.59 arc90 96.19,8.61 96.19,2.06 arc-90 93.19,0.05

### Text on the board
bNames: Funded by Trenton Evans / UNL ECEN Capstone Team 4: SGS Rev. 2 / - Aidan Colling / - Michael Goberling / - Jacob Pilakowski